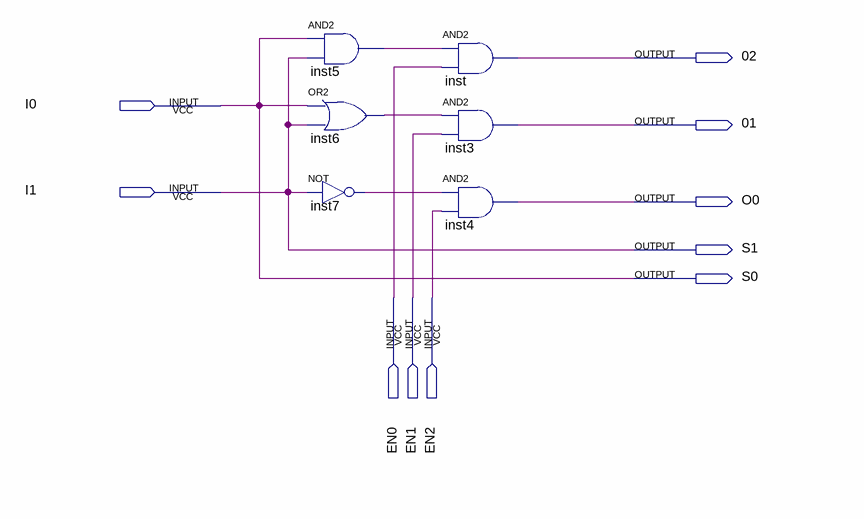
[diagram p0: schematic sheet]
// Quartus schematic logic_unit.bdf as structural Verilog: 6 symbols, 10 pins
module logic_unit (
  input  I0,
  input  I1,
  input  EN0,
  input  EN1,
  input  EN2,
  output \02 ,
  output \01 ,
  output O0,
  output S1,
  output S0
);

  wire inst5_out, inst6_out, inst7_out;

  and inst5 (inst5_out, I0, I1);
  or inst6 (inst6_out, I0, I1);
  not inst7 (inst7_out, I1);
  and inst (\02 , inst5_out, EN0);
  and inst3 (\01 , inst6_out, EN1);
  and inst4 (O0, inst7_out, EN2);

  assign S0 = I0;
  assign S1 = I1;
endmodule
